# Altium schematic sheet matrix.SchDoc
size A3
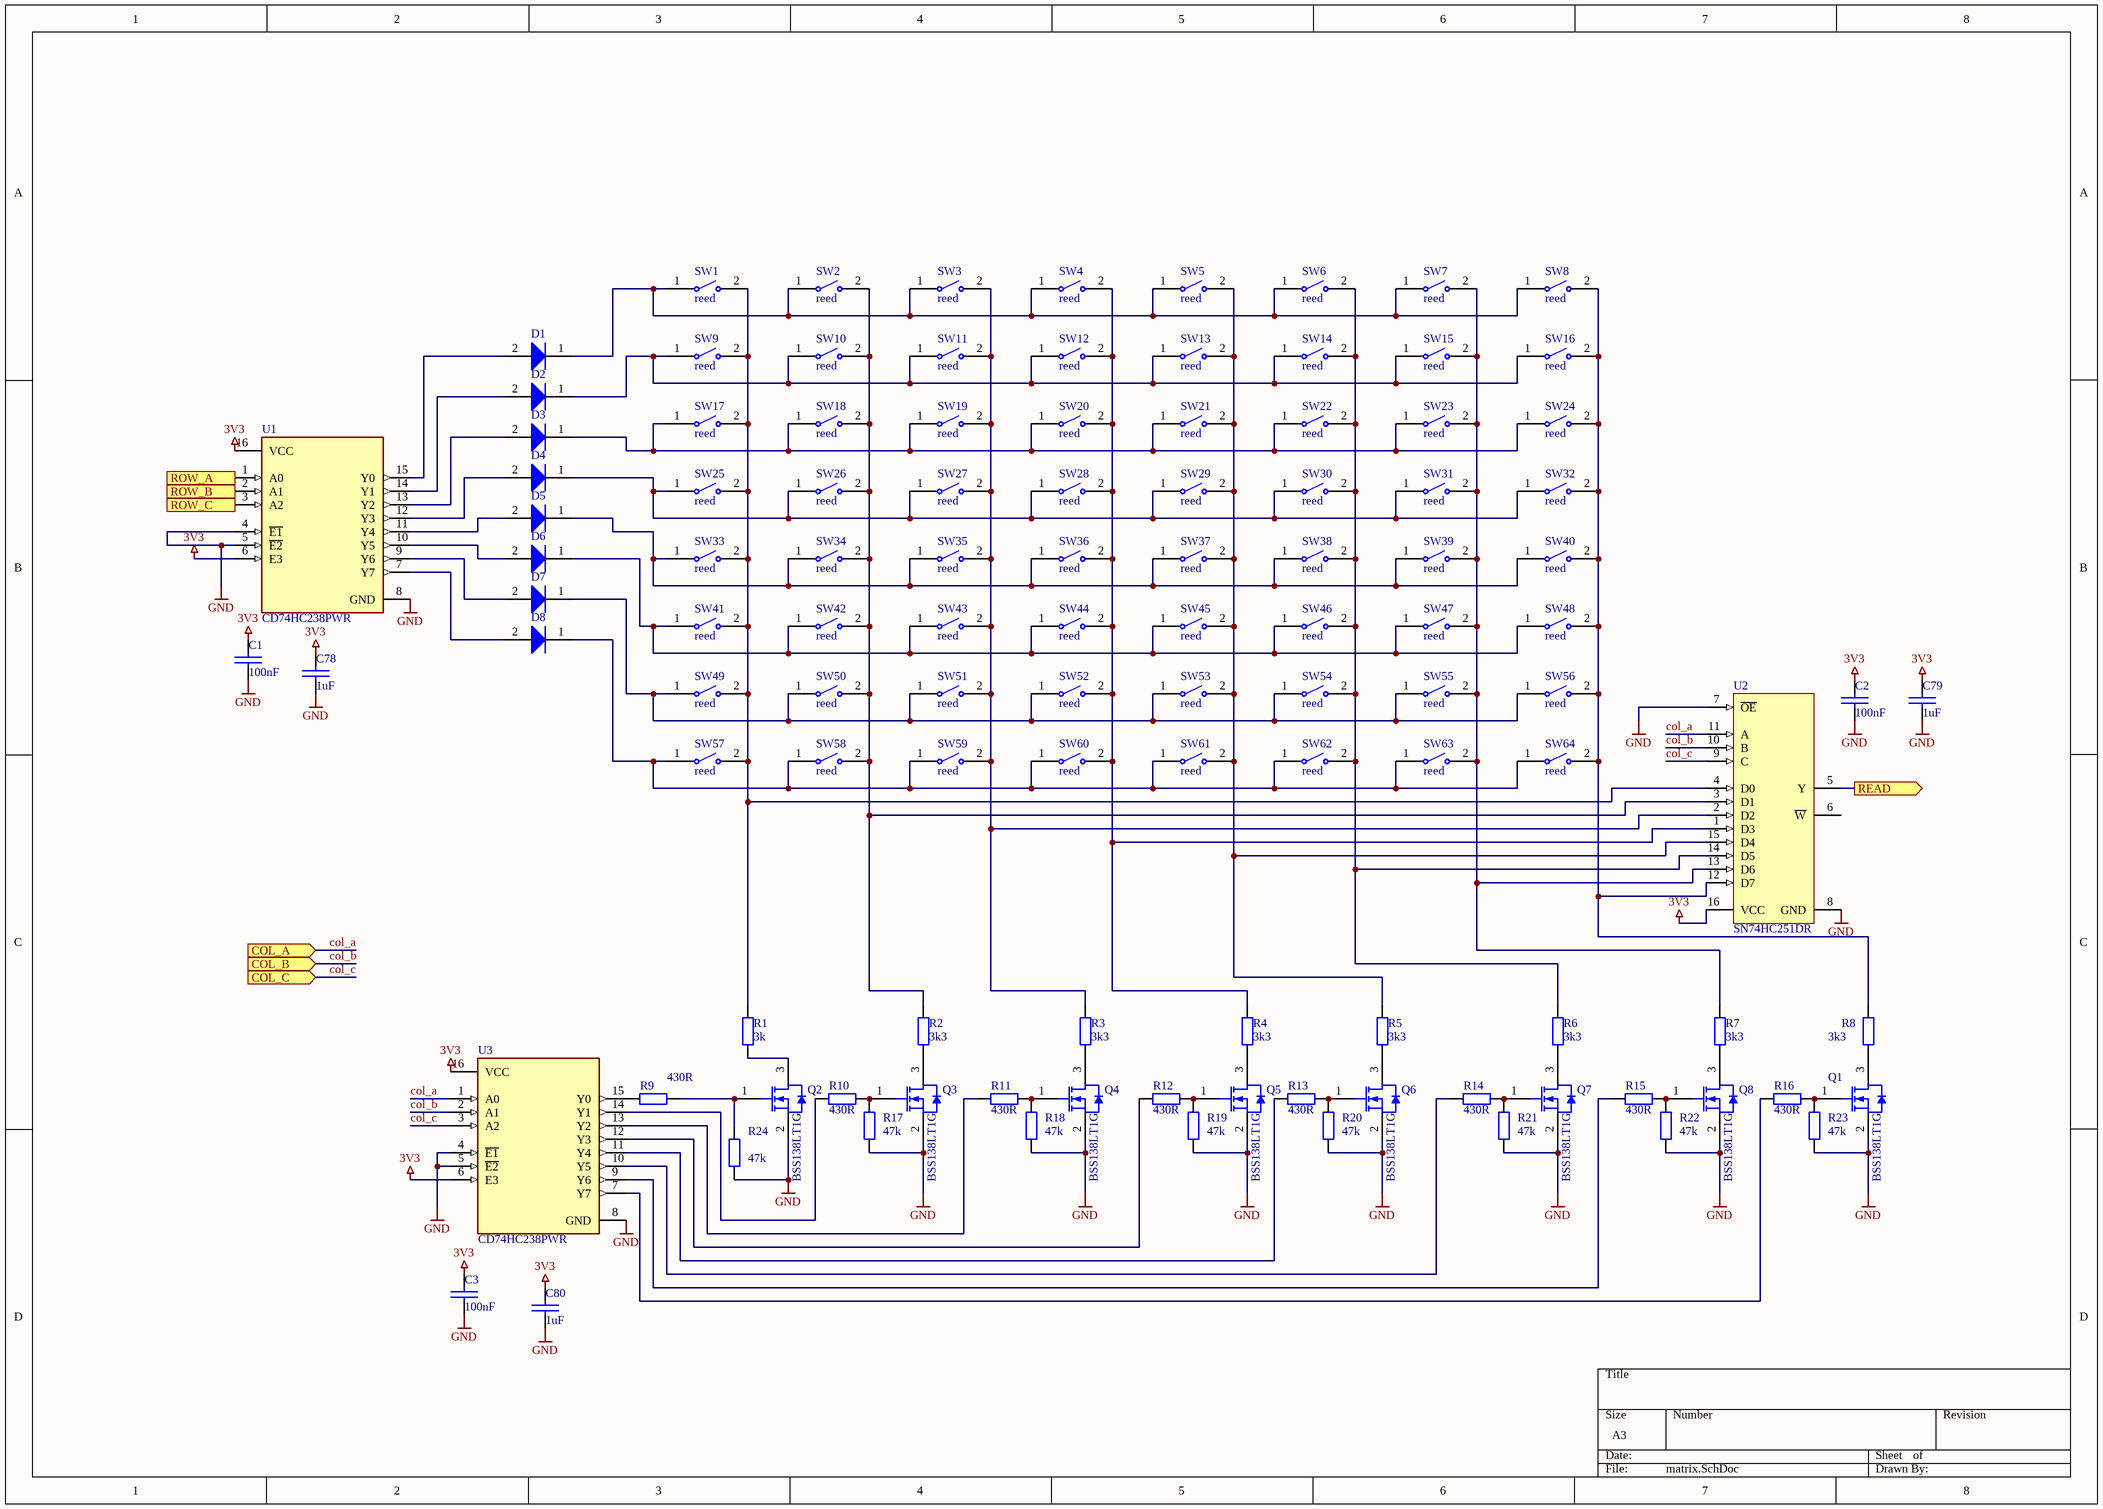
[diagram p0: matrix.SchDoc]

## Parts
C1  100nF  [Cap_0805]
C2  100nF  [Cap_0805]
C3  100nF  [Cap_0805]
C78  1uF  [Cap_0805]
C79  1uF  [Cap_0805]
C80  1uF  [Cap_0805]
D1  BAT54HT1G  [ONSC-SOD-323-2-477-02_V]  (value not drawn)
D2  BAT54HT1G  [ONSC-SOD-323-2-477-02_V]  (value not drawn)
D3  BAT54HT1G  [ONSC-SOD-323-2-477-02_V]  (value not drawn)
D4  BAT54HT1G  [ONSC-SOD-323-2-477-02_V]  (value not drawn)
D5  BAT54HT1G  [ONSC-SOD-323-2-477-02_V]  (value not drawn)
D6  BAT54HT1G  [ONSC-SOD-323-2-477-02_V]  (value not drawn)
D7  BAT54HT1G  [ONSC-SOD-323-2-477-02_V]  (value not drawn)
D8  BAT54HT1G  [ONSC-SOD-323-2-477-02_V]  (value not drawn)
Q1  BSS138LT1G  [ONSC-SOT-23-3-318-08_V]
Q2  BSS138LT1G  [ONSC-SOT-23-3-318-08_V]
Q3  BSS138LT1G  [ONSC-SOT-23-3-318-08_V]
Q4  BSS138LT1G  [ONSC-SOT-23-3-318-08_V]
Q5  BSS138LT1G  [ONSC-SOT-23-3-318-08_V]
Q6  BSS138LT1G  [ONSC-SOT-23-3-318-08_V]
Q7  BSS138LT1G  [ONSC-SOT-23-3-318-08_V]
Q8  BSS138LT1G  [ONSC-SOT-23-3-318-08_V]
R1  value 3k  [RES_0805]  (hidden comment: 430R)
R2  value 3k3  [RES_0805]  (hidden comment: 430R)
R3  value 3k3  [RES_0805]  (hidden comment: 430R)
R4  value 3k3  [RES_0805]  (hidden comment: 430R)
R5  value 3k3  [RES_0805]  (hidden comment: 430R)
R6  value 3k3  [RES_0805]  (hidden comment: 430R)
R7  value 3k3  [RES_0805]  (hidden comment: 430R)
R8  value 3k3  [RES_0805]  (hidden comment: 430R)
R9  430R  [RES_0805]
R10  430R  [RES_0805]
R11  430R  [RES_0805]
R12  430R  [RES_0805]
R13  430R  [RES_0805]
R14  430R  [RES_0805]
R15  430R  [RES_0805]
R16  430R  [RES_0805]
R17  value 47k  [RES_0805]  (hidden comment: 10k)
R18  value 47k  [RES_0805]  (hidden comment: 10k)
R19  value 47k  [RES_0805]  (hidden comment: 10k)
R20  value 47k  [RES_0805]  (hidden comment: 10k)
R21  value 47k  [RES_0805]  (hidden comment: 10k)
R22  value 47k  [RES_0805]  (hidden comment: 10k)
R23  value 47k  [RES_0805]  (hidden comment: 10k)
R24  value 47k  [RES_0805]  (hidden comment: 10k)
SW1  reed  [reed]
SW2  reed  [reed]
SW3  reed  [reed]
SW4  reed  [reed]
SW5  reed  [reed]
SW6  reed  [reed]
SW7  reed  [reed]
SW8  reed  [reed]
SW9  reed  [reed]
SW10  reed  [reed]
SW11  reed  [reed]
SW12  reed  [reed]
SW13  reed  [reed]
SW14  reed  [reed]
SW15  reed  [reed]
SW16  reed  [reed]
SW17  reed  [reed]
SW18  reed  [reed]
SW19  reed  [reed]
SW20  reed  [reed]
SW21  reed  [reed]
SW22  reed  [reed]
SW23  reed  [reed]
SW24  reed  [reed]
SW25  reed  [reed]
SW26  reed  [reed]
SW27  reed  [reed]
SW28  reed  [reed]
SW29  reed  [reed]
SW30  reed  [reed]
SW31  reed  [reed]
SW32  reed  [reed]
SW33  reed  [reed]
SW34  reed  [reed]
SW35  reed  [reed]
SW36  reed  [reed]
SW37  reed  [reed]
SW38  reed  [reed]
SW39  reed  [reed]
SW40  reed  [reed]
SW41  reed  [reed]
SW42  reed  [reed]
SW43  reed  [reed]
SW44  reed  [reed]
SW45  reed  [reed]
SW46  reed  [reed]
SW47  reed  [reed]
SW48  reed  [reed]
SW49  reed  [reed]
SW50  reed  [reed]
SW51  reed  [reed]
SW52  reed  [reed]
SW53  reed  [reed]
SW54  reed  [reed]
SW55  reed  [reed]
SW56  reed  [reed]
SW57  reed  [reed]
SW58  reed  [reed]
SW59  reed  [reed]
SW60  reed  [reed]
SW61  reed  [reed]
SW62  reed  [reed]
SW63  reed  [reed]
SW64  reed  [reed]
U1  CD74HC238PWR  [FP-PW0016A-IPC_A]
U2  SN74HC251DR  [D0016A_L]
U3  CD74HC238PWR  [FP-PW0016A-IPC_A]

## Ports
COL_A (in), COL_B (in), COL_C (in), READ (out), ROW_A (in), ROW_B (in), ROW_C (in)

## Nets
3V3: C1.1 C2.1 C3.1 C78.1 C79.1 C80.1 U1.6(E3) U1.16(VCC) U2.16(VCC) U3.6(E3) U3.16(VCC)
GND: C1.2 C2.2 C3.2 C78.2 C79.2 C80.2 Q1.2(S) Q2.2(S) Q3.2(S) Q4.2(S) Q5.2(S) Q6.2(S) Q7.2(S) Q8.2(S) R17.1 R18.1 R19.1 R20.1 R21.1 R22.1 R23.1 R24.1 U1.4(~{E1}) U1.5(~{E2}) U1.8(GND) U2.7(~{OE}) U2.8(GND) U3.4(~{E1}) U3.5(~{E2}) U3.8(GND)
col_a: U2.11(A) U3.1(A0) ; port COL_A
col_b: U2.10(B) U3.2(A1) ; port COL_B
col_c: U2.9(C) U3.3(A2) ; port COL_C
READ: U2.5(Y) ; port READ
ROW_A: U1.1(A0) ; port ROW_A
ROW_B: U1.2(A1) ; port ROW_B
ROW_C: U1.3(A2) ; port ROW_C
NetD1_1: D1.1(K) SW1.1 SW2.1 SW3.1 SW4.1 SW5.1 SW6.1 SW7.1 SW8.1
NetD1_2: D1.2(A) U1.15(Y0)
NetD2_1: D2.1(K) SW9.1 SW10.1 SW11.1 SW12.1 SW13.1 SW14.1 SW15.1 SW16.1
NetD2_2: D2.2(A) U1.14(Y1)
NetD3_1: D3.1(K) SW17.1 SW18.1 SW19.1 SW20.1 SW21.1 SW22.1 SW23.1 SW24.1
NetD3_2: D3.2(A) U1.13(Y2)
NetD4_1: D4.1(K) SW25.1 SW26.1 SW27.1 SW28.1 SW29.1 SW30.1 SW31.1 SW32.1
NetD4_2: D4.2(A) U1.12(Y3)
NetD5_1: D5.1(K) SW33.1 SW34.1 SW35.1 SW36.1 SW37.1 SW38.1 SW39.1 SW40.1
NetD5_2: D5.2(A) U1.11(Y4)
NetD6_1: D6.1(K) SW41.1 SW42.1 SW43.1 SW44.1 SW45.1 SW46.1 SW47.1 SW48.1
NetD6_2: D6.2(A) U1.10(Y5)
NetD7_1: D7.1(K) SW49.1 SW50.1 SW51.1 SW52.1 SW53.1 SW54.1 SW55.1 SW56.1
NetD7_2: D7.2(A) U1.9(Y6)
NetD8_1: D8.1(K) SW57.1 SW58.1 SW59.1 SW60.1 SW61.1 SW62.1 SW63.1 SW64.1
NetD8_2: D8.2(A) U1.7(Y7)
NetQ1_1: Q1.1(G) R16.1 R23.2
NetQ1_3: Q1.3(D) R8.2
NetQ2_1: Q2.1(G) R9.1 R24.2
NetQ2_3: Q2.3(D) R1.2
NetQ3_1: Q3.1(G) R10.1 R17.2
NetQ3_3: Q3.3(D) R2.2
NetQ4_1: Q4.1(G) R11.1 R18.2
NetQ4_3: Q4.3(D) R3.2
NetQ5_1: Q5.1(G) R12.1 R19.2
NetQ5_3: Q5.3(D) R4.2
NetQ6_1: Q6.1(G) R13.1 R20.2
NetQ6_3: Q6.3(D) R5.2
NetQ7_1: Q7.1(G) R14.1 R21.2
NetQ7_3: Q7.3(D) R6.2
NetQ8_1: Q8.1(G) R15.1 R22.2
NetQ8_3: Q8.3(D) R7.2
NetR1_1: R1.1 SW1.2 SW9.2 SW17.2 SW25.2 SW33.2 SW41.2 SW49.2 SW57.2 U2.4(D0)
NetR2_1: R2.1 SW2.2 SW10.2 SW18.2 SW26.2 SW34.2 SW42.2 SW50.2 SW58.2 U2.3(D1)
NetR3_1: R3.1 SW3.2 SW11.2 SW19.2 SW27.2 SW35.2 SW43.2 SW51.2 SW59.2 U2.2(D2)
NetR4_1: R4.1 SW4.2 SW12.2 SW20.2 SW28.2 SW36.2 SW44.2 SW52.2 SW60.2 U2.1(D3)
NetR5_1: R5.1 SW5.2 SW13.2 SW21.2 SW29.2 SW37.2 SW45.2 SW53.2 SW61.2 U2.15(D4)
NetR6_1: R6.1 SW6.2 SW14.2 SW22.2 SW30.2 SW38.2 SW46.2 SW54.2 SW62.2 U2.14(D5)
NetR7_1: R7.1 SW7.2 SW15.2 SW23.2 SW31.2 SW39.2 SW47.2 SW55.2 SW63.2 U2.13(D6)
NetR8_1: R8.1 SW8.2 SW16.2 SW24.2 SW32.2 SW40.2 SW48.2 SW56.2 SW64.2 U2.12(D7)
NetR9_2: R9.2 U3.15(Y0)
NetR10_2: R10.2 U3.14(Y1)
NetR11_2: R11.2 U3.13(Y2)
NetR12_2: R12.2 U3.12(Y3)
NetR13_2: R13.2 U3.11(Y4)
NetR14_2: R14.2 U3.10(Y5)
NetR15_2: R15.2 U3.9(Y6)
NetR16_2: R16.2 U3.7(Y7)

Not connected (* = marked no-connect by the designer): U2 6(~{W})

## Library data of the parts
C1-C3 C78-C80 = C: SDTSourceLibName: C:\WINDOWS\TEMP\DA.LIB; PCB Footprint: RC0805
D1-D8 = CMP-1055-00462-1: Schottky Barrier Diode, 2-Pin SOD-323, Pb-Free, Tape and Reel; Manufacturer: On Semiconductor; Configuration: Single; trr Max (ns): 5; IFSM Max (A): 0.6; ComponentLink3URL: http://www.onsemi.com/pub_link/Collateral/477-02.PDF.1; PackageDescription: 2-Pin SOD, Body 1.7 x 1.25 mm; ComponentLink2URL: http://www.onsemi.cn/pub_link/Collateral/BAT54HT1-D.PDF; ComponentLink3Description: Package Specification; ComponentLink2Description: Datasheet; DatasheetVersion: Rev. 6; PackageReference: SOD-323-2-477-02; RoHS: TRUE; ComponentLink1URL: http://www.onsemi.com/; Packing: Tape and Reel; PartNumber: BAT54HT1G; Mounting Technology: Surface Mount; ComponentLink1Description: Manufacturer URL; PackageVersion: Rev. H, 03/2007
Q1-Q8 = CMP-1058-00767-1: Power MOSFET, 200 mA, 50 V, N-Channel, 3-Pin SOT-23, Pb-Free, Tape and Reel; Manufacturer: On Semiconductor; PD Max (W): 0.225; Coss Typ (pF): 12; V(BR)DSS Min (V): 50; VGS Max (V): 20; Channel Polarity: N Channel; Configuration: Single; VGS(th) Max (V): 1.5; Ciss Typ (pF): 40; Crss Typ (pF): 3.5; ID Max (A): 0.2; ComponentLink3Description: Package Specification; PackageDescription: 3-Pin Small Outline Transistor, Body 2.92 x 1.3 mm, Pitch 0.95 mm; PackageReference: SOT-23-3-318-08; RoHS: Pb-Free; Mounting Technology: Surface Mount; ComponentLink1Description: Manufacturer URL; ComponentLink2URL: http://www.onsemi.com/pub_link/Collateral/BSS138LT1-D.PDF; ComponentLink2Description: Datasheet; Packing: Tape and Reel; PackageVersion: Rev. AP, 11/2009; PartNumber: BSS138LT1G; Package Type: SOT-23-3; ComponentLink1URL: http://www.onsemi.com/; DatasheetVersion: Rev. 8; ComponentLink3URL: http://www.onsemi.cn/pub_link/Collateral/318-08.PDF
R1-R24 = Res2: Res 0805; Published: 8-Jun-2000; LatestRevisionDate: 17-Jul-2002; LatestRevisionNote: Re-released for DXP Platform.; PackageReference: AXIAL-0.4; Publisher: Altium Limited; PackageDescription: Axial Device, Thru-Hole; 2 Leads; 0.4 in Pin Spacing
  R9-R16: Value: 430R
U1 U3 = CMP-1633-00899-3: IC DECODER/DEMUX 1X3:8 16TSSOP; Max Supply Voltage: 6V; Low Level Output Current: 5.2mA; Number of Channels: 1; Quiescent Current: 8uA; Min Supply Voltage: 2V; Supply Type: Single; Polarity: Non-Inverting; Number of Input Lines: 3; Output Current: 25mA; Turn-On Delay Time: 265ns; Number of Output Lines: 8; Logic Function: Demultiplexer; High Level Output Current: -5.2mA; Rise Time: 400ns; Bandwidth: 28MHz; Max Operating Temperature: 125°C; Independent Circuits: 1; Weight: 0.002183oz; Radiation Hardening: No; Output Voltage: 6V; Min Operating Temperature: -55°C; Package Quantity: 2000; REACH SVHC: No SVHC; Packaging: Tape and Reel; Lead Free: Lead Free; Contact Plating: Gold; Mount: Surface Mount; Height: 1.15mm; Case/Package: TSSOP; Number of Bits: 8; Number of Inputs: 3; Termination: SMD/SMT; Number of Outputs: 8; Number of Pins: 16; Number of Circuits: 1; Max Supply Current: 8uA; Series: 74HC; Number of Elements: 1; RoHS Compliant: Yes; Length: 5mm; Propagation Delay: 265ns; Width: 4.4mm; Technology: CMOS; Max Frequency: 28MHz
U2 = CMP-1633-00067-2: Data Selectors/Multiplexers With 3-State Outputs, D0016A, LARGE T&R; Manufacturer: Texas Instruments; Input Type: LVTTL/CMOS; Rating: Catalog; F @ Nom Voltage(Max)(Mhz): 28; Voltage(Nom)(V): 3.3,5; tpd @ Nom Voltage(Max)(ns): 51; Schmitt Trigger: No; VCC(Max)(V): 6; VCC(Min)(V): 2; Channels(#): 1; Configuration: 8：1; Bits(#): 8; Function: Encoder/Multiplexer; ICC @ Nom Voltage(Max)(mA): 0.08; Output Type: CMOS; Technology Family: HC; Output Drive (IOL/IOH)(Max)(mA): 7.8/-7.8; PackageReference: D0016A; Type: 3-State Output; Operating Temperature Range(C): -40 to 85; Code_JEDEC: MS-012 variation AC; DatasheetVersion: SCLS132E; Generic Part Number: SN74HC251